# Altium schematic sheet Interface 21.04.33.SchDoc
size 203 x 165 mm; SheetNumber: 1; SheetTotal: 1
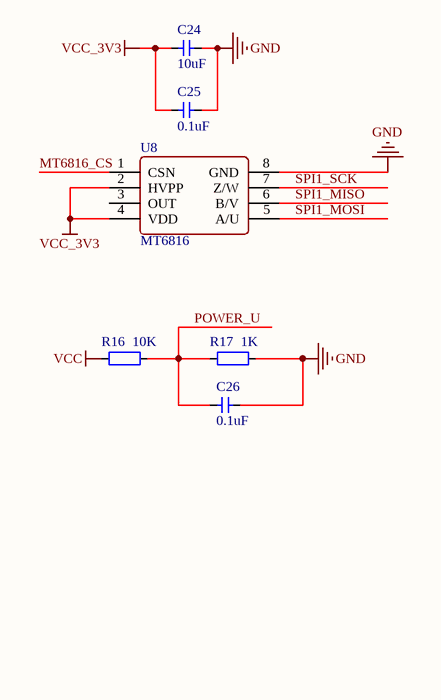
[diagram p0: Interface 21.04.33.SchDoc]

## Parts
C24  10uF  [CAP_0402]
C25  0.1uF  [CAP_0402]
C26  0.1uF  [CAP_0402]
R16  10K  [RES_0402]
R17  1K  [RES_0402]
U8  MT6816  [SO-8]

## Nets
GND: C24.1 C25.1 C26.1 R17.2 U8.8(GND)
VCC: R16.1
VCC_3V3: C24.2 C25.2 U8.2(HVPP) U8.4(VDD)
MT6816_CS: U8.1(CSN)
POWER_U: C26.2 R16.2 R17.1
SPI1_MISO: U8.6(B/V)
SPI1_MOSI: U8.5(A/U)
SPI1_SCK: U8.7(Z/W)

Not connected (* = marked no-connect by the designer): U8 3(OUT)

## Library data of the parts
C24-C26 = 电容-0402: Capacitor; Value: 0.1u
R16 R17 = 电阻-0402: Resistor; Value: 22R
U8 = MT6816: Magnetic Position Sensor